# EAGLE schematic BCMv4 (EAGLE 9.6.2)
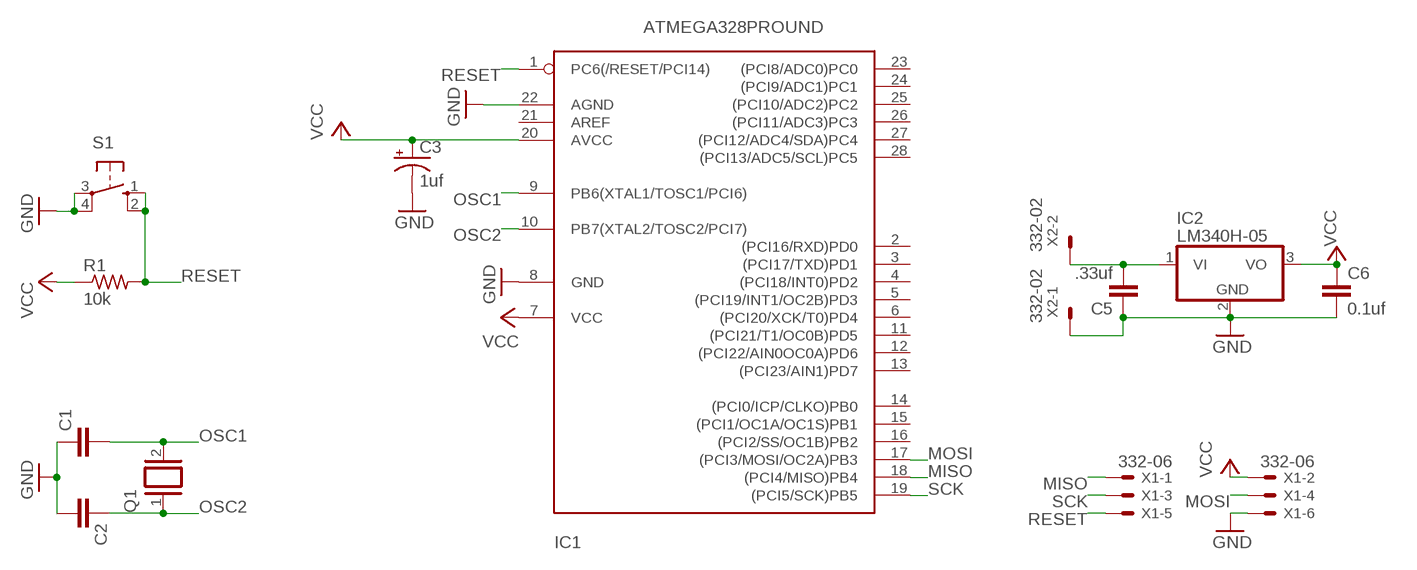
[diagram p0: schematic, sheet 1]

## Parts
C1  C2,5-3  [C2.5-3]
C2  C2,5-3  [C2.5-3]
C3  1uf  CPOL-USE2.5-6  [E2,5-6]
C5  .33uf  C2,5-3  [C2.5-3]
C6  0.1uf  C2,5-3  [C2.5-3]
IC1  ATMEGA328PROUND  [DIL28-3-ROUND]
IC2  LM340H-05  [TO220H]
Q1  XTAL/S  [QS]
R1  10k  R-US_0204/7  [0204/7]
S1  10-XX  [B3F-10XX]
X1  332-06  [332-06]
X2  332-02  [332-02]

## Nets
GND: C1.1 C2.2 C3.- C5.1 C6.2 IC1.8(GND) IC1.22(AGND) IC2.2(GND) S1.3(P) S1.4(P1) X1.6 X2.1
MISO: IC1.18((PCI4/MISO)PB4) X1.1
MOSI: IC1.17((PCI3/MOSI/OC2A)PB3) X1.4
N$3: C5.2 IC2.1(VI) X2.2
OSC1: C1.2 IC1.9(PB6(XTAL1/TOSC1/PCI6)) Q1.2
OSC2: C2.1 IC1.10(PB7(XTAL2/TOSC2/PCI7)) Q1.1
RESET: IC1.1(PC6(/RESET/PCI14)) R1.2 S1.1(S) S1.2(S1) X1.5
SCK: IC1.19((PCI5/SCK)PB5) X1.3
VCC: C3.+ C6.1 IC1.7(VCC) IC1.20(AVCC) IC2.3(VO) R1.1 X1.2
Unconnected: IC1.2((PCI16/RXD)PD0) IC1.3((PCI17/TXD)PD1) IC1.4((PCI18/INT0)PD2) IC1.5((PCI19/INT1/OC2B)PD3) IC1.6((PCI20/XCK/T0)PD4) IC1.11((PCI21/T1/OC0B)PD5) IC1.12((PCI22/AIN0OC0A)PD6) IC1.13((PCI23/AIN1)PD7) IC1.14((PCI0/ICP/CLKO)PB0) IC1.15((PCI1/OC1A/OC1S)PB1) IC1.16((PCI2/SS/OC1B)PB2) IC1.21(AREF) IC1.23((PCI8/ADC0)PC0) IC1.24((PCI9/ADC1)PC1) IC1.25((PCI10/ADC2)PC2) IC1.26((PCI11/ADC3)PC3) IC1.27((PCI12/ADC4/SDA)PC4) IC1.28((PCI13/ADC5/SCL)PC5)

## Library data of the parts
C1 C2 C5 C6 = capacitor-wima:C: CAPACITOR naming: grid - package width
C3 = rcl:CPOL-US: POLARIZED CAPACITOR, American symbol; SPICEPREFIX: C
IC1 = atmega328:ATMEGA328*P: MICROCONTROLLER 32 kBytes FLASH 2 kBytes SRAM 1 kBytes EEPROM USART 8-channel 10 bit ADC
IC2 = linear:LM340?-*: Positive VOLTAGE REGULATOR Source: http://cache.national.com/ds/LM/LM340.pdf
Q1 = special:XTAL/S: CRYSTAL
R1 = rcl:R-US_: RESISTOR, American symbol; SPICEPREFIX: R
S1 = switch-omron:10-XX: OMRON SWITCH; MPN: B3F-1000; OC_FARNELL: 176432; OC_NEWARK: 36M3542
X1 = con-garry:332-06: 6 Pin - 2mm Dual Row Source: www.mpe-connector.de / garry_shortform_2012.pdf
X2 = con-garry:332-02: 2 Pin - 2mm Dual Row Source: www.mpe-connector.de / garry_shortform_2012.pdf